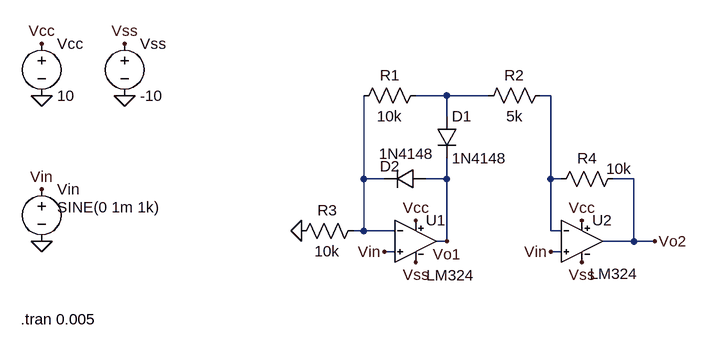
[diagram p0: schematic Circuito3.asc]
Circuito3.asc, the LTspice schematic file:
Version 4
SHEET 1 880 680
WIRE 0 0 -48 0
WIRE 64 0 0 0
WIRE 160 0 144 0
WIRE 0 32 0 0
WIRE -128 128 -128 0
WIRE -96 128 -128 128
WIRE 0 128 0 96
WIRE 0 128 -32 128
WIRE 160 128 160 0
WIRE 176 128 160 128
WIRE 288 128 256 128
WIRE -128 208 -128 128
WIRE -128 208 -144 208
WIRE -80 208 -128 208
WIRE 160 208 160 128
WIRE 176 208 160 208
WIRE 0 224 0 128
WIRE 0 224 -16 224
WIRE 288 224 288 128
WIRE 288 224 240 224
WIRE 320 224 288 224
WIRE -80 240 -96 240
WIRE 176 240 160 240
FLAG -224 208 0
FLAG 0 224 Vo1
FLAG 320 224 Vo2
FLAG -624 -80 Vcc
FLAG -48 192 Vcc
FLAG 208 192 Vcc
FLAG -496 -80 Vss
FLAG -48 256 Vss
FLAG 208 256 Vss
FLAG -624 0 0
FLAG -496 0 0
FLAG -624 224 0
FLAG -624 144 Vin
FLAG -96 240 Vin
FLAG 160 240 Vin
SYMBOL diode -16 32 R0
SYMATTR InstName D1
SYMATTR Value 1N4148
SYMBOL diode -32 112 R90
WINDOW 0 12 56 VBottom 2
WINDOW 3 -38 30 VTop 2
SYMATTR InstName D2
SYMATTR Value 1N4148
SYMBOL AutoGenerated\\LM324 -48 224 R0
WINDOW 3 54 37 Top 2
SYMATTR InstName U1
SYMBOL res -32 -16 R90
WINDOW 0 0 56 VBottom 2
WINDOW 3 32 56 VTop 2
SYMATTR InstName R1
SYMATTR Value 10k
SYMATTR SpiceLine tol=1
SYMBOL res 160 -16 R90
WINDOW 0 0 56 VBottom 2
WINDOW 3 32 56 VTop 2
SYMATTR InstName R2
SYMATTR Value 5k
SYMATTR SpiceLine tol=1
SYMBOL res -128 192 R90
WINDOW 0 0 56 VBottom 2
WINDOW 3 32 56 VTop 2
SYMATTR InstName R3
SYMATTR Value 10k
SYMATTR SpiceLine tol=1
SYMBOL res 272 112 R90
WINDOW 0 0 56 VBottom 2
WINDOW 3 -15 7 VTop 2
SYMATTR InstName R4
SYMATTR Value 10k
SYMATTR SpiceLine tol=1
SYMBOL AutoGenerated\\LM324 208 224 R0
WINDOW 3 49 34 Top 2
SYMATTR InstName U2
SYMBOL voltage -624 -96 R0
SYMATTR InstName Vcc
SYMATTR Value 10
SYMBOL voltage -496 -96 R0
SYMATTR InstName Vss
SYMATTR Value -10
SYMBOL voltage -624 128 R0
WINDOW 3 24 44 Left 2
WINDOW 123 0 0 Left 0
WINDOW 39 0 0 Left 0
SYMATTR Value SINE(0 1m 1k)
SYMATTR InstName Vin
TEXT -656 344 Left 2 !.tran 0.005

The netlist it stands for:
* Circuito3.asc
D1 N001 Vo1 1N4148
D2 Vo1 N003 1N4148
XU1 Vin N003 Vcc Vss Vo1 LM324  ; pins In+ In- V+ V- OUT
R1 N001 N003 10k tol=1
R2 N002 N001 5k tol=1
R3 N003 0 10k tol=1
R4 Vo2 N002 10k tol=1
XU2 Vin N002 Vcc Vss Vo2 LM324  ; pins In+ In- V+ V- OUT
Vcc Vcc 0 10
Vss Vss 0 -10
Vin Vin 0 SINE(0 1m 1k)
.model D D
.lib standard.dio
.tran 0.005
.lib E:\LtSpice_components\LM324.ti.lib
.backanno
.end